# EAGLE schematic flex10k10 (EAGLE 7.2.0)
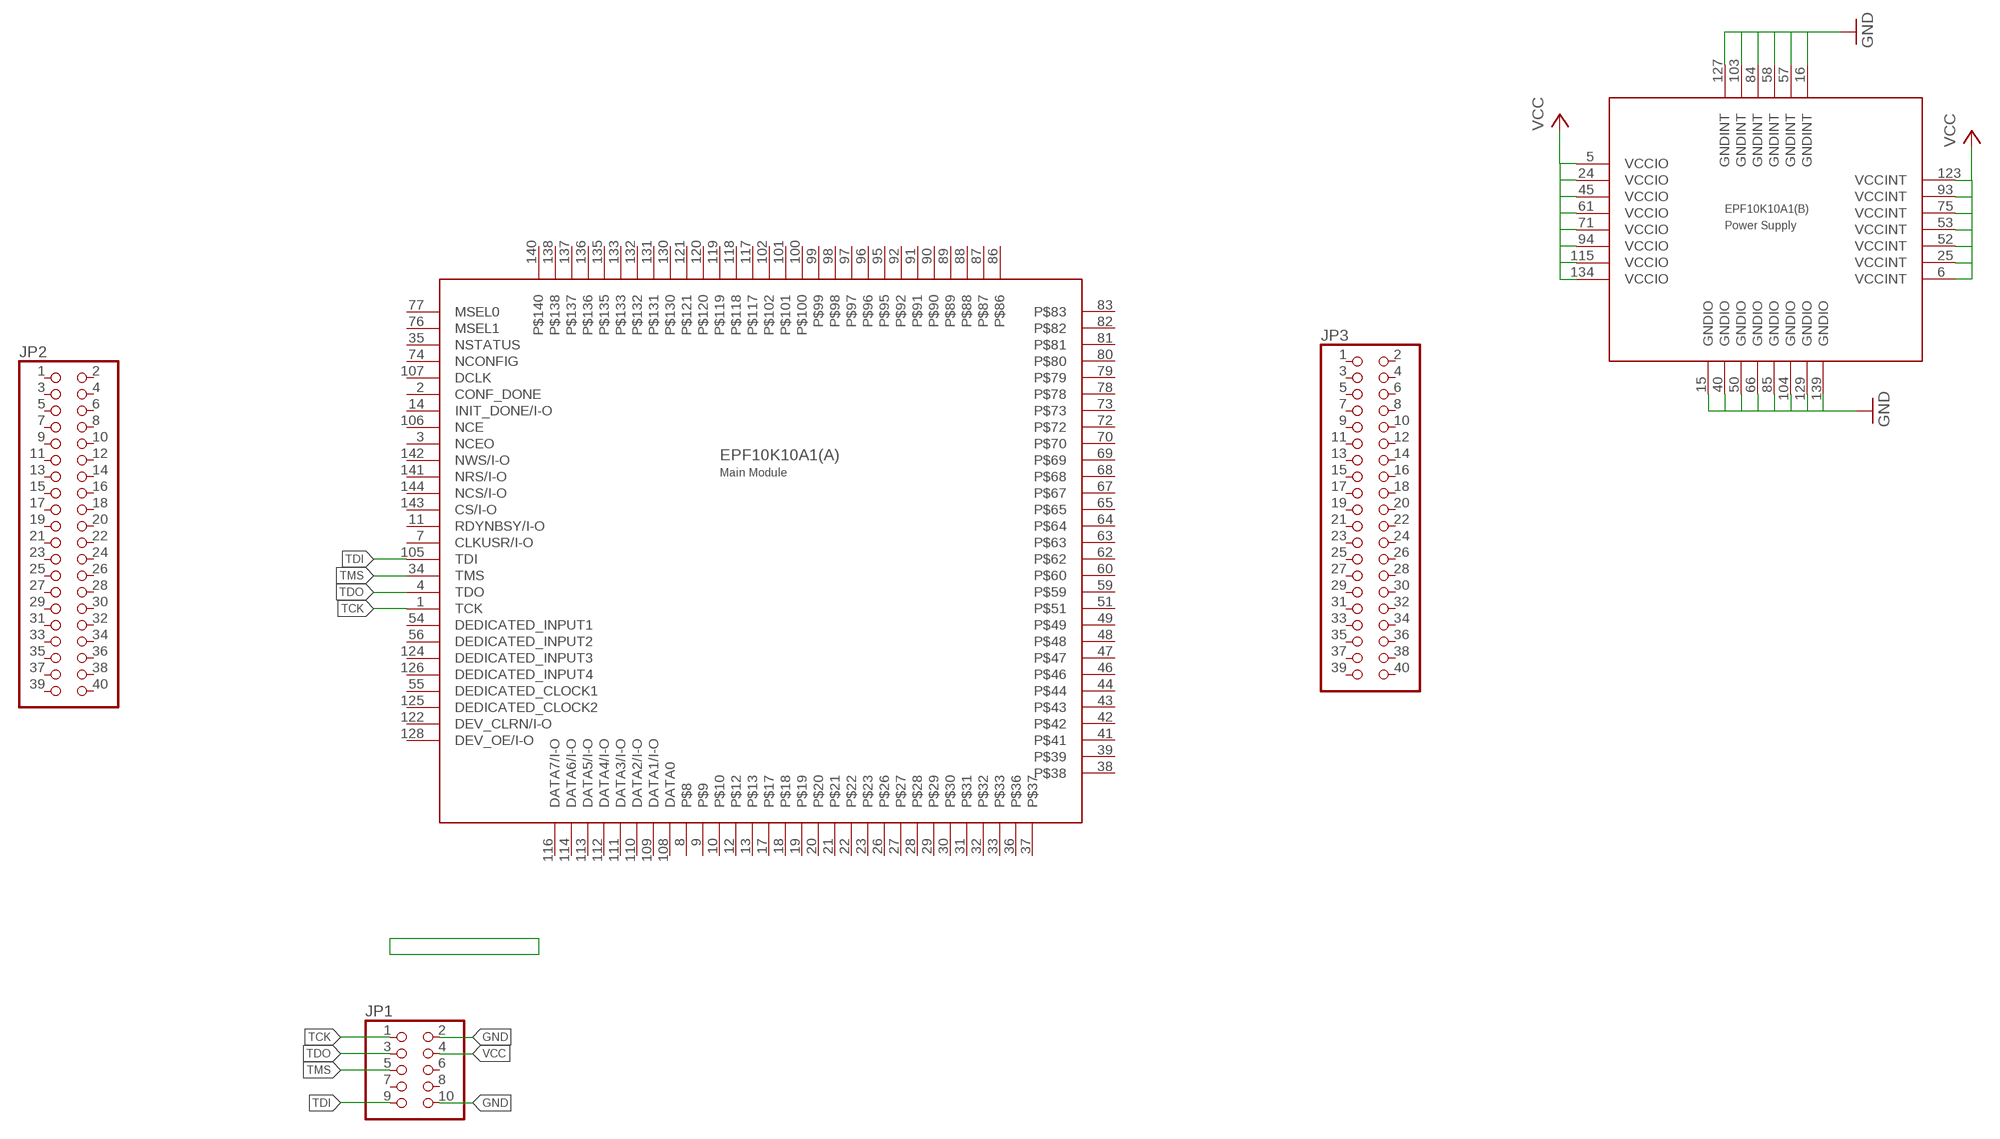
[diagram p0: schematic, sheet 1]

## Parts
EPF10K10A1  ALTERA_EPF10K10A  [144TQFP]
JP1  PINHD-2X05_2.54-SMD  [2X05SMD]
JP2  PINHD-2X20/OCT  [2X20]
JP3  PINHD-2X20/OCT  [2X20]

## Nets
GND: EPF10K10A1.15((B):GNDIO) EPF10K10A1.16((B):GNDINT) EPF10K10A1.40((B):GNDIO) EPF10K10A1.50((B):GNDIO) EPF10K10A1.57((B):GNDINT) EPF10K10A1.58((B):GNDINT) EPF10K10A1.66((B):GNDIO) EPF10K10A1.84((B):GNDINT) EPF10K10A1.85((B):GNDIO) EPF10K10A1.103((B):GNDINT) EPF10K10A1.104((B):GNDIO) EPF10K10A1.127((B):GNDINT) EPF10K10A1.129((B):GNDIO) EPF10K10A1.139((B):GNDIO) JP1.2 JP1.10
TCK: EPF10K10A1.1((A):TCK) JP1.1
TDI: EPF10K10A1.105((A):TDI) JP1.9
TDO: EPF10K10A1.4((A):TDO) JP1.3
TMS: EPF10K10A1.34((A):TMS) JP1.5
VCC: EPF10K10A1.5((B):VCCIO) EPF10K10A1.6((B):VCCINT) EPF10K10A1.24((B):VCCIO) EPF10K10A1.25((B):VCCINT) EPF10K10A1.45((B):VCCIO) EPF10K10A1.52((B):VCCINT) EPF10K10A1.53((B):VCCINT) EPF10K10A1.61((B):VCCIO) EPF10K10A1.71((B):VCCIO) EPF10K10A1.75((B):VCCINT) EPF10K10A1.93((B):VCCINT) EPF10K10A1.94((B):VCCIO) EPF10K10A1.115((B):VCCIO) EPF10K10A1.123((B):VCCINT) EPF10K10A1.134((B):VCCIO) JP1.4
Unconnected: EPF10K10A1.2((A):CONF_DONE) EPF10K10A1.3((A):NCEO) EPF10K10A1.7((A):CLKUSR/I-O) EPF10K10A1.8 EPF10K10A1.9 EPF10K10A1.10 EPF10K10A1.11((A):RDYNBSY/I-O) EPF10K10A1.12 EPF10K10A1.13 EPF10K10A1.14((A):INIT_DONE/I-O) EPF10K10A1.17 EPF10K10A1.18 EPF10K10A1.19 EPF10K10A1.20 EPF10K10A1.21 EPF10K10A1.22 EPF10K10A1.23 EPF10K10A1.26 EPF10K10A1.27 EPF10K10A1.28 EPF10K10A1.29 EPF10K10A1.30 EPF10K10A1.31 EPF10K10A1.32 EPF10K10A1.33 EPF10K10A1.35((A):NSTATUS) EPF10K10A1.36 EPF10K10A1.37 EPF10K10A1.38 EPF10K10A1.39 EPF10K10A1.41 EPF10K10A1.42 EPF10K10A1.43 EPF10K10A1.44 EPF10K10A1.46 EPF10K10A1.47 EPF10K10A1.48 EPF10K10A1.49 EPF10K10A1.51 EPF10K10A1.54((A):DEDICATED_INPUT1) EPF10K10A1.55((A):DEDICATED_CLOCK1) EPF10K10A1.56((A):DEDICATED_INPUT2) EPF10K10A1.59 EPF10K10A1.60 EPF10K10A1.62 EPF10K10A1.63 EPF10K10A1.64 EPF10K10A1.65 EPF10K10A1.67 EPF10K10A1.68 EPF10K10A1.69 EPF10K10A1.70 EPF10K10A1.72 EPF10K10A1.73 EPF10K10A1.74((A):NCONFIG) EPF10K10A1.76((A):MSEL1) EPF10K10A1.77((A):MSEL0) EPF10K10A1.78 EPF10K10A1.79 EPF10K10A1.80 EPF10K10A1.81 EPF10K10A1.82 EPF10K10A1.83 EPF10K10A1.86 EPF10K10A1.87 EPF10K10A1.88 EPF10K10A1.89 EPF10K10A1.90 EPF10K10A1.91 EPF10K10A1.92 EPF10K10A1.95 EPF10K10A1.96 EPF10K10A1.97 EPF10K10A1.98 EPF10K10A1.99 EPF10K10A1.100 EPF10K10A1.101 EPF10K10A1.102 EPF10K10A1.106((A):NCE) EPF10K10A1.107((A):DCLK) EPF10K10A1.108((A):DATA0) EPF10K10A1.109((A):DATA1/I-O) EPF10K10A1.110((A):DATA2/I-O) EPF10K10A1.111((A):DATA3/I-O) EPF10K10A1.112((A):DATA4/I-O) EPF10K10A1.113((A):DATA5/I-O) EPF10K10A1.114((A):DATA6/I-O) EPF10K10A1.116((A):DATA7/I-O) EPF10K10A1.117 EPF10K10A1.118 EPF10K10A1.119 EPF10K10A1.120 EPF10K10A1.121 EPF10K10A1.122((A):DEV_CLRN/I-O) EPF10K10A1.124((A):DEDICATED_INPUT3) EPF10K10A1.125((A):DEDICATED_CLOCK2) EPF10K10A1.126((A):DEDICATED_INPUT4) EPF10K10A1.128((A):DEV_OE/I-O) EPF10K10A1.130 EPF10K10A1.131 EPF10K10A1.132 EPF10K10A1.133 EPF10K10A1.135 EPF10K10A1.136 EPF10K10A1.137 EPF10K10A1.138 EPF10K10A1.140 EPF10K10A1.141((A):NRS/I-O) EPF10K10A1.142((A):NWS/I-O) EPF10K10A1.143((A):CS/I-O) EPF10K10A1.144((A):NCS/I-O) JP1.6 JP1.7 JP1.8 JP2.1 JP2.2 JP2.3 JP2.4 JP2.5 JP2.6 JP2.7 JP2.8 JP2.9 JP2.10 JP2.11 JP2.12 JP2.13 JP2.14 JP2.15 JP2.16 JP2.17 JP2.18 JP2.19 JP2.20 JP2.21 JP2.22 JP2.23 JP2.24 JP2.25 JP2.26 JP2.27 JP2.28 JP2.29 JP2.30 JP2.31 JP2.32 JP2.33 JP2.34 JP2.35 JP2.36 JP2.37 JP2.38 JP2.39 JP2.40 JP3.1 JP3.2 JP3.3 JP3.4 JP3.5 JP3.6 JP3.7 JP3.8 JP3.9 JP3.10 JP3.11 JP3.12 JP3.13 JP3.14 JP3.15 JP3.16 JP3.17 JP3.18 JP3.19 JP3.20 JP3.21 JP3.22 JP3.23 JP3.24 JP3.25 JP3.26 JP3.27 JP3.28 JP3.29 JP3.30 JP3.31 JP3.32 JP3.33 JP3.34 JP3.35 JP3.36 JP3.37 JP3.38 JP3.39 JP3.40

## Library data of the parts
EPF10K10A1 = sx2_epf10k10a_epc2_c6713:ALTERA_EPF10K10A
JP1 = pinhead-2:PINHD-2X05: PIN HEADER
JP2 JP3 = pinhead_v2:PINHD-2X20: PIN HEADER